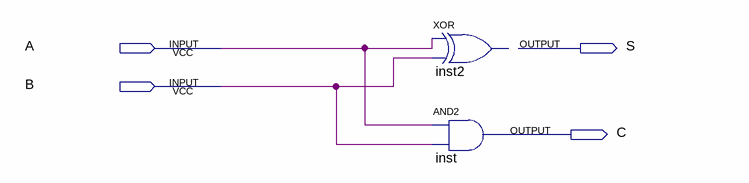
[diagram p0: schematic sheet]
// Quartus schematic half_adder.bdf as structural Verilog: 2 symbols, 4 pins
module half_adder (
  input  A,
  input  B,
  output S,
  output C
);

  // XOR inst2 has open pins: IN1=A, IN2=B, OUT=open
  and inst (C, A, B);
endmodule
